# Altium schematic sheet Motor DC.SchDoc
size B
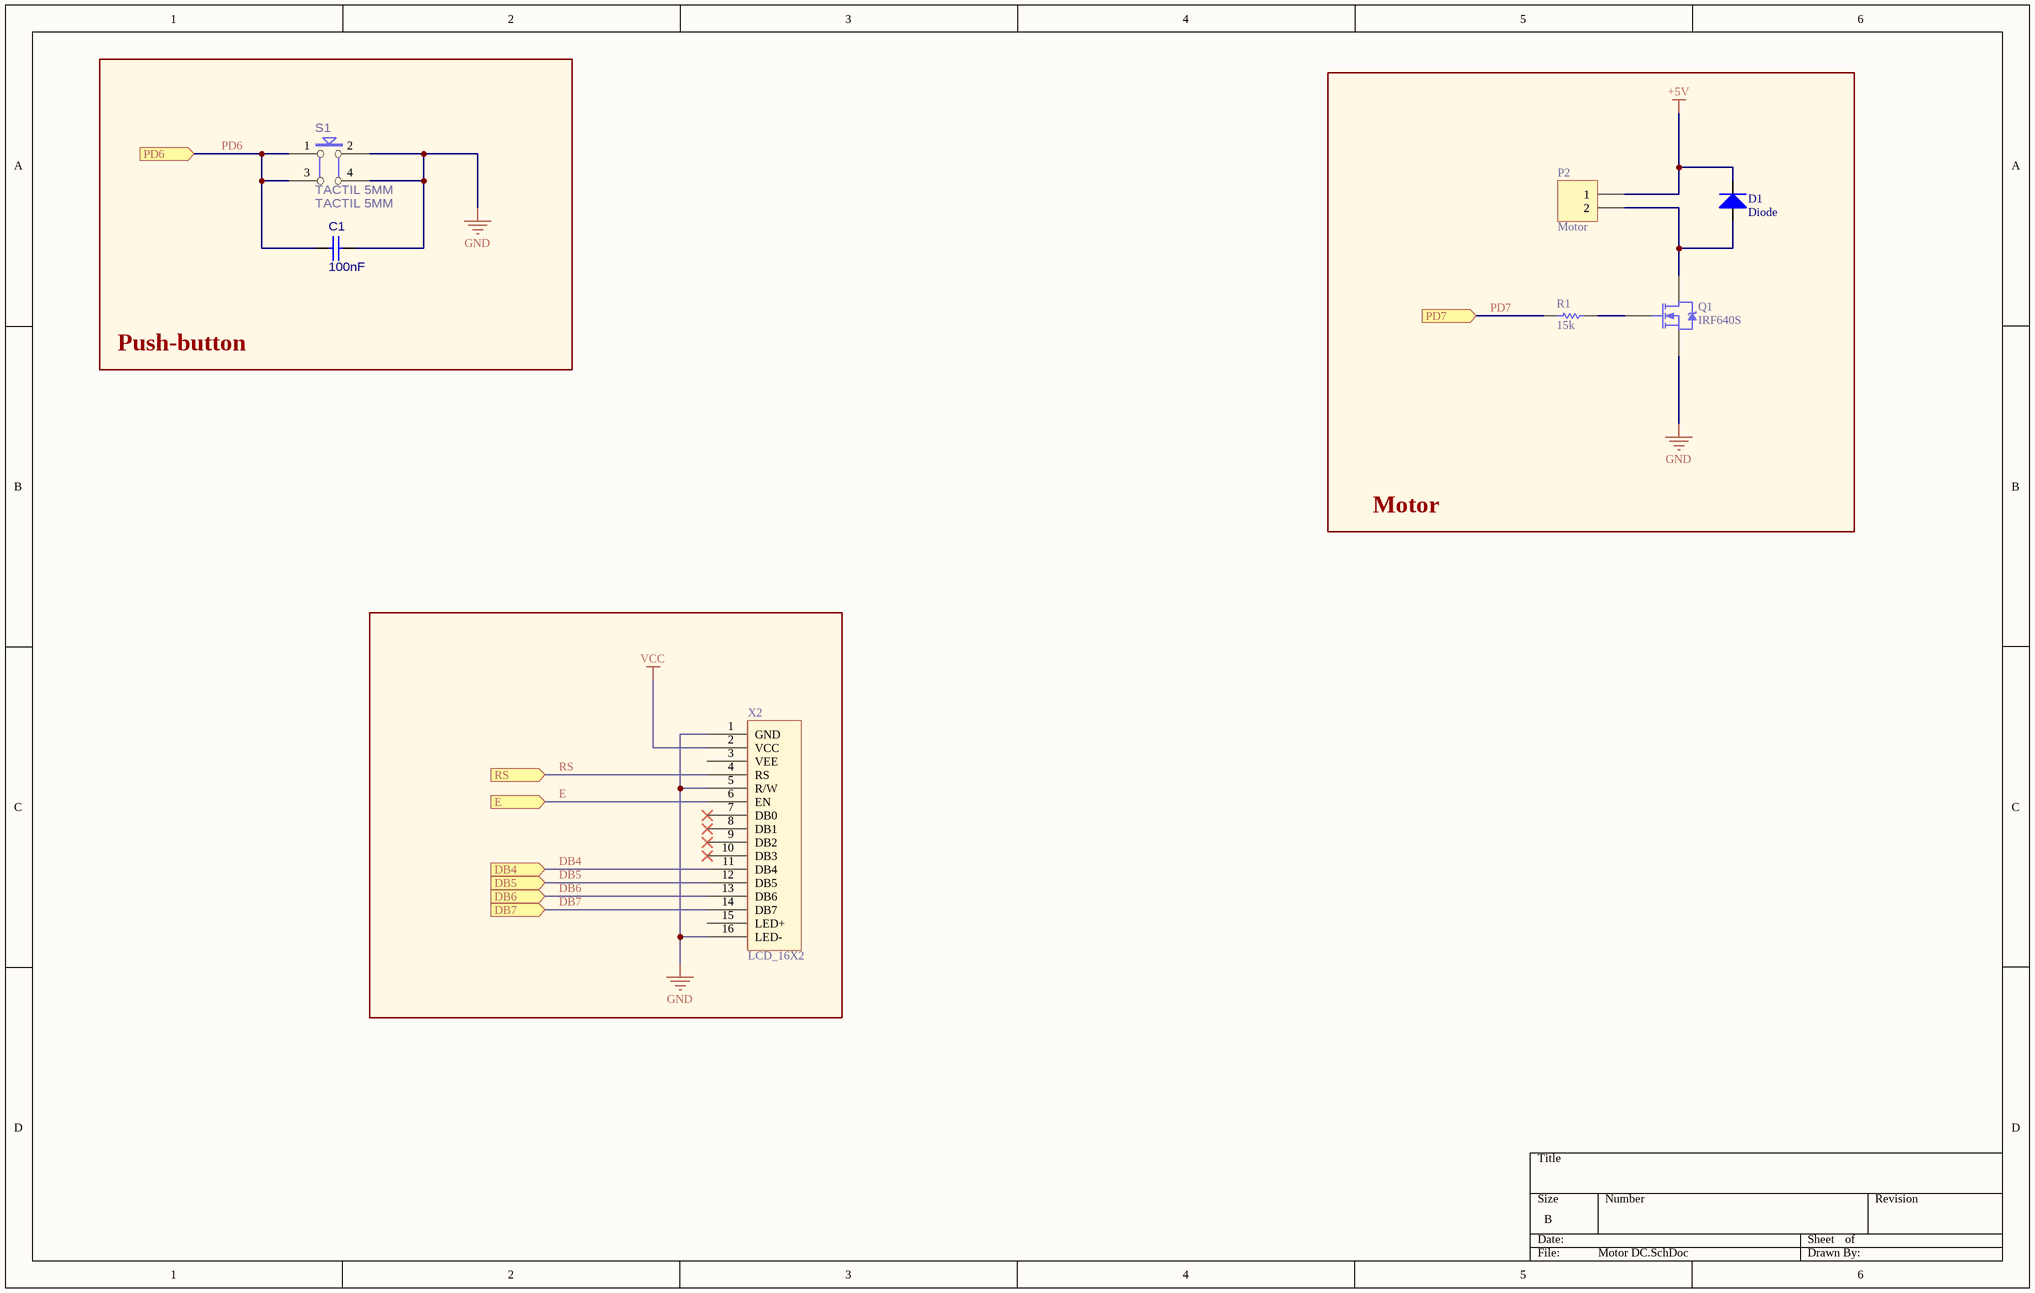
[diagram p0: Motor DC.SchDoc]

## Parts
C1  100nF  [CAP_ELETR_16x25 - 90]
D1  Diode
P2  Motor  [HDR1X2]
Q1  IRF640S  [D2PAK_N]
R1  15k  [RES0402]
S1  TACTIL 5MM  [TACTIL 5MM]
X2  LCD_16X2  [LCD8X2]

## Blocks framed on the sheet
Push-button: C1 S1
Motor: D1 P2 Q1 R1

## Ports
DB4 (in), DB5 (in), DB6 (in), DB7 (in), E (in), PD6 (in), PD7 (in), RS (in)

## Nets
+5V: D1.2(K) P2.1
GND: C1.2 Q1.3(S) S1.2 S1.4 X2.1(GND) X2.5(R/W) X2.16(LED-)
VCC: X2.2(VCC)
DB4: X2.11(DB4) ; port DB4
DB5: X2.12(DB5) ; port DB5
DB6: X2.13(DB6) ; port DB6
DB7: X2.14(DB7) ; port DB7
E: X2.6(EN) ; port E
PD6: C1.1 S1.1 S1.3 ; port PD6
PD7: R1.1 ; port PD7
RS: X2.4(RS) ; port RS
NetD1_1: D1.1(A) P2.2 Q1.2(D)
NetQ1_1: Q1.1(G) R1.2

Not connected (* = marked no-connect by the designer): X2 3(VEE) 7(DB0)* 8(DB1)* 9(DB2)* 10(DB3)* 15(LED+)

## Library data of the parts
C1 = CAP_4: Footprint: 0805CAP; Digikey: 1276-1007-1-ND; Value: 100nF
D1 = Diode: Default Diode
P2 = Header 2: Header, 2-Pin; LatestRevisionDate: 17-Jul-2002; LatestRevisionNote: Re-released for DXP Platform.; Publisher: Altium Limited
Q1 = IRF640S: HEXFET N-Channel Power MOSFET; Published: 8-Jun-2000; LatestRevisionDate: 20-Nov-2009; LatestRevisionNote: IPC-7351 Footprint Added.; DatasheetVersion: Jul-1999; PackageReference: D2PAK; Publisher: Altium Limited; PackageDescription: 3-Pin Transistor Outline Package 2.54 mm Pitch, 15.1 mm Lead Span; ComponentLink1Description: Manufacturer Link; ComponentLink1URL: http://www.irf.com/; ComponentLink2Description: Datasheet; ComponentLink2URL: http://www.irf.com/product-info/datasheets/data/irf640s.pdf
R1 = Res1: Resistor; Value: 15k
S1 = PUSH-BUTTON: ClassName: PUSH_BUTTON; Value: TACTIL 5MM